# Altium schematic sheet AD9834.SchDoc
size A4
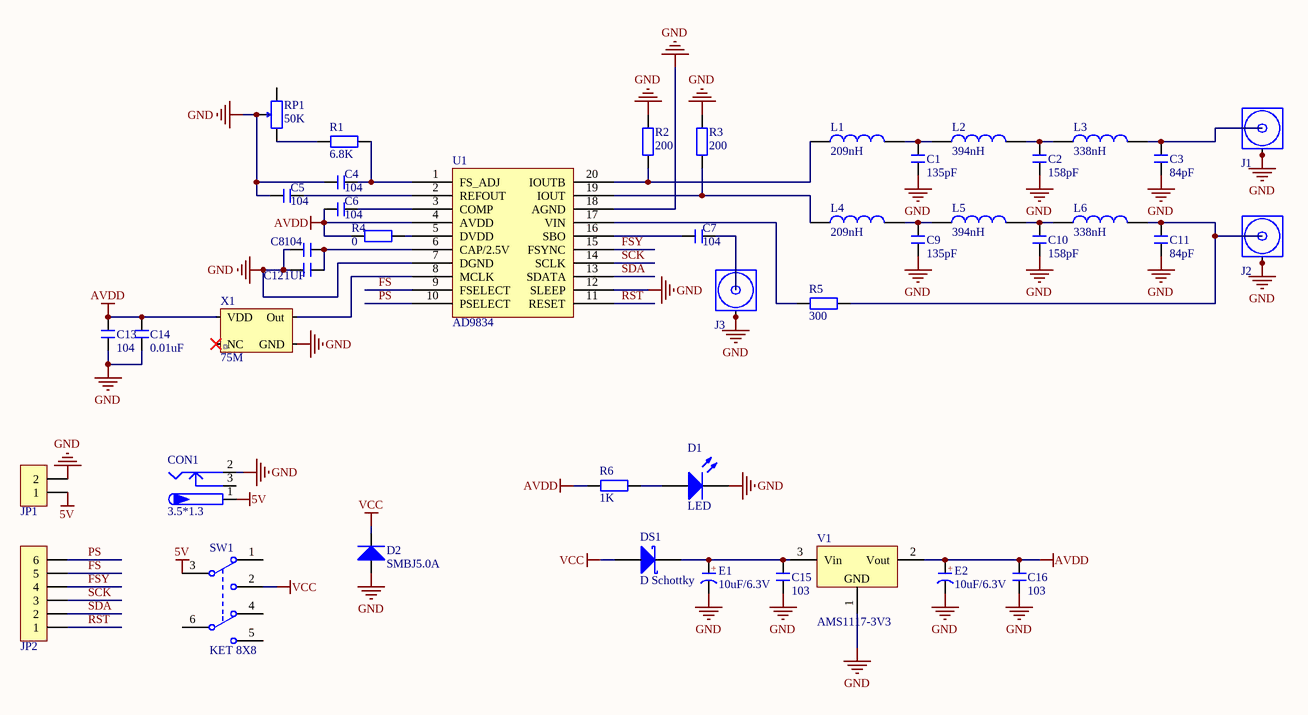
[diagram p0: AD9834.SchDoc]

## Parts
C1  135pF  [C 0603]
C2  158pF  [C 0603]
C3  84pF  [C 0603]
C4  104  [C 0805]
C5  104  [C 0805]
C6  104  [C 0805]
C7  104  [C 0805]
C8  104  [C 0805]
C9  135pF  [C 0603]
C10  158pF  [C 0603]
C11  84pF  [C 0603]
C12  1UF  [C 0805]
C13  104  [C 0805]
C14  0.01uF  [C 0805]
C15  103  [C 0805]
C16  103  [C 0805]
CON1  3.5*1.3  [DC-005]
D1  LED  [LED_0805]
D2  Type: SMBJ5.0A  [DIODE-SMB]  (hidden comment: TVS)
DS1  D Schottky  [SMB]
E1  10uF/6.3V  [CD B(3528)]
E2  10uF/6.3V  [CD B(3528)]
J1  COAX  [MCX5.08-5-H]  (value not drawn)
J2  COAX  [MCX5.08-5-H]  (value not drawn)
J3  COAX  [MCX5.08-5-H]  (value not drawn)
JP1  HDR-1X2  [XH2.54-2P_H]  (value not drawn)
JP2  HDR-1X6  [HDR-1X6]  (value not drawn)
L1  209nH  [L 0603]
L2  394nH  [L 0603]
L3  338nH  [L 0603]
L4  209nH  [L 0603]
L5  394nH  [L 0603]
L6  338nH  [L 0603]
R1  6.8K  [R 0603]
R2  200  [R 0603]
R3  200  [R 0603]
R4  0  [R 0603]
R5  300  [R 0603]
R6  1K  [R 0805]
RP1  50K  [3296W]
SW1  KET 8X8  [KFT DIP-8X8]
U1  AD9834  [TSSOP20_N]
V1  AMS1117-3V3  [SOT223_N]
X1  75M  [X-CPX75]

## Nets
5V: CON1.1 JP1.1 SW1.3(NO1)
AVDD: C6.1 C13.2 C14.2 C16.2 E2.1(A) R4.1 R6.1 U1.4(AVDD) V1.2(Vout) X1.4(VDD)
GND: C1.1 C2.1 C3.1 C4.1 C5.1 C8.1 C9.1 C10.1 C11.1 C12.1 C13.1 C14.1 C15.1 C16.1 CON1.2 D1.2(K) D2.1(A) E1.2(K) E2.2(K) J1.2(GND) J1.3(GND) J1.4(GND) J1.5(GND) J2.2(GND) J2.3(GND) J2.4(GND) J2.5(GND) J3.2(GND) J3.3(GND) J3.4(GND) J3.5(GND) JP1.2 R2.1 R3.1 RP1.2 U1.7(DGND) U1.12(SLEEP) U1.18(AGND) V1.1(GND) X1.2(GND)
VCC: D2.2(K) DS1.1 SW1.2(COM2)
FS: JP2.5 U1.9(FSELECT)
FSY: JP2.4 U1.15(FSYNC)
PS: JP2.6 U1.10(PSELECT)
RST: JP2.1 U1.11(RESET)
SCK: JP2.3 U1.14(SCLK)
SDA: JP2.2 U1.13(SDATA)
NetC1_2: C1.2 L1.2 L2.1
NetC2_2: C2.2 L2.2 L3.1
NetC3_2: C3.2 J1.1(Signal) L3.2
NetC4_2: C4.2 R1.2 U1.1(FS_ADJ)
NetC5_2: C5.2 U1.2(REFOUT)
NetC6_2: C6.2 U1.3(COMP)
NetC7_1: C7.1 U1.16(SBO)
NetC7_2: C7.2 J3.1(Signal)
NetC8_2: C8.2 C12.2 U1.6(CAP/2.5V)
NetC9_2: C9.2 L4.2 L5.1
NetC10_2: C10.2 L5.2 L6.1
NetC11_2: C11.2 J2.1(Signal) L6.2 R5.2
NetC15_2: C15.2 DS1.2 E1.1(A) V1.3(Vin)
NetD1_1: D1.1(A) R6.2
NetL1_1: L1.1 R2.2 U1.20(IOUTB)
NetL4_1: L4.1 R3.2 U1.19(IOUT)
NetR1_1: R1.1 RP1.1
NetR4_2: R4.2 U1.5(DVDD)
NetR5_1: R5.1 U1.17(VIN)
NetU1_8: U1.8(MCLK) X1.3(Out)

Not connected (* = marked no-connect by the designer): CON1 3; RP1 3; SW1 1(NC1) 4(NO2) 5(COM2) 6(NC2); X1 1(NC)*

## Notes on the sheet
- (in symbol C-CD) +

## Library data of the parts
C1-C16 = C: 无极性贴片电容; 版权归属: 源创客; BOM名称: 无极性贴片电容; 学习资源: www.ooocke.com
CON1 = P-DC: 低压电源接口; BOM名称: DC电源接口; 版权归属: 源创客; 学习资源: www.ooocke.com
D1 = LED: 发光二极管; Published: 8-Jun-2000; LatestRevisionDate: 08-Jul-2005; LatestRevisionNote: Mech Layer 1 removed.; PackageReference: LED; Publisher: Altium Limited
D2 = TVS: TVS保护; Published: 8-Jun-2000; LatestRevisionDate: 17-Jul-2002; LatestRevisionNote: Re-released for DXP Platform.; PackageDocument: Sep-1996; PackageReference: SMC; Publisher: Altium Limited; Code_JEDEC: DO-214-AB
DS1 = D Schottky: Schottky Diode; Published: 8-Jun-2000; LatestRevisionDate: 17-Jul-2002; LatestRevisionNote: Re-released for DXP Platform.; PackageReference: SMB; Publisher: Altium Limited; PackageDescription: DO-214-AA/SMB; 2 C-Bend Leads; Body 5.3 x 3.6 mm, inc. leads (LxW); Code_JEDEC: DO-214-AA
E1 E2 = C-CD: 贴片钽电容; 版权归属: 源创客; BOM名称: 贴片钽电容; 学习资源: www.ooocke.com
JP1 = Header 2: 2P接插件; 版权归属: 源创客; BOM名称: 2P接插件; 学习资源: www.ooocke.com
JP2 = Header 6: 6P接插件; 版权归属: 源创客; BOM名称: 6P接插件; 学习资源: www.ooocke.com
L1-L6 = L: 小功率贴片电感; 版权归属: 源创客; BOM名称: 小功率贴片电感; 学习资源: www.ooocke.com
R1-R6 = R: 贴片电阻; 版权归属: 源创客; BOM名称: 贴片电阻; 学习资源: www.ooocke.com
RP1 = RP-ID: 插件单联电位器; BOM名称: 插件电位器; 版权归属: 源创客; 学习资源: www.ooocke.com
SW1 = KET 8X8: 8*8自锁开关; 版权归属: 源创客; BOM名称: 8*8自锁开关; 学习资源: www.ooocke.com
U1 = AD9834: 20mW Power,2,3V to 5.5V,75MHz, Complete DDS
V1 = AMS1117: 三端稳压芯片; BOM名称: 稳压芯片; 版权归属: 源创客; 学习资源: www.ooocke.com
X1 = XTAL_Oscillator: 有源晶振; Frequency: 75M